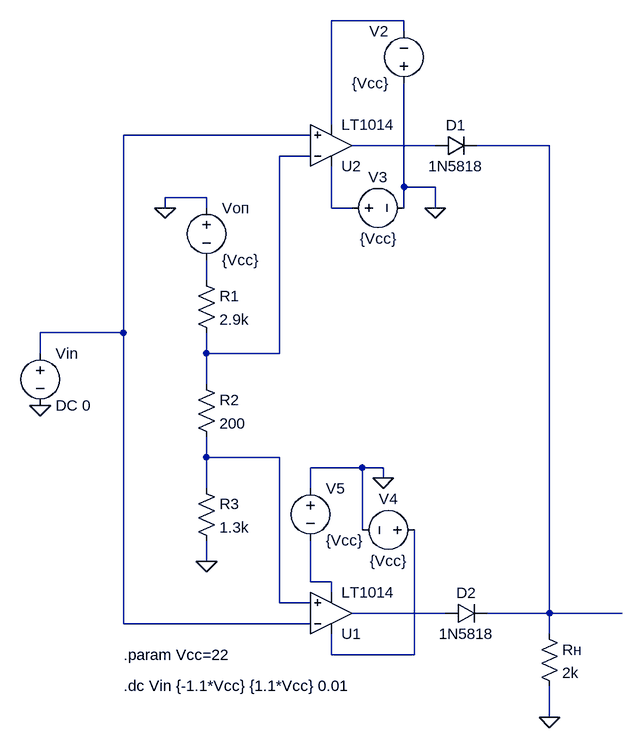
[diagram p0: schematic scheme11.asc]
scheme11.asc, the LTspice schematic file:
Version 4.1
SHEET 1 880 848
WIRE 400 -336 288 -336
WIRE 400 -320 400 -336
WIRE 288 -176 288 -336
WIRE 256 -160 -32 -160
WIRE 448 -144 320 -144
WIRE 624 -144 512 -144
WIRE 256 -128 208 -128
WIRE 400 -80 400 -240
WIRE 448 -80 400 -80
WIRE 96 -64 32 -64
WIRE 32 -48 32 -64
WIRE 96 -48 96 -64
WIRE 288 -48 288 -112
WIRE 320 -48 288 -48
WIRE 400 -48 400 -80
WIRE 448 -48 448 -80
WIRE 96 64 96 32
WIRE -32 144 -32 -160
WIRE -32 144 -160 144
WIRE -160 176 -160 144
WIRE 96 176 96 144
WIRE 208 176 208 -128
WIRE 208 176 96 176
WIRE 96 224 96 176
WIRE 96 336 96 304
WIRE 208 336 96 336
WIRE 336 352 256 352
WIRE 368 352 336 352
WIRE 368 368 368 352
WIRE 96 384 96 336
WIRE 256 384 256 352
WIRE 336 448 336 352
WIRE 96 496 96 464
WIRE 256 528 256 464
WIRE 288 528 256 528
WIRE 288 544 288 528
WIRE 208 560 208 336
WIRE 256 560 208 560
WIRE 464 576 320 576
WIRE 624 576 624 -144
WIRE 624 576 528 576
WIRE 736 576 624 576
WIRE -32 592 -32 144
WIRE 256 592 -32 592
WIRE 624 608 624 576
WIRE 288 640 288 608
WIRE 416 640 416 448
WIRE 416 640 288 640
WIRE 624 736 624 688
FLAG 624 736 0
FLAG -160 256 0
FLAG 448 -48 0
FLAG 368 368 0
FLAG 32 -48 0
FLAG 96 496 0
SYMBOL res 80 48 R0
SYMATTR InstName R1
SYMATTR Value 2.9k
SYMBOL res 80 208 R0
SYMATTR InstName R2
SYMATTR Value 200
SYMBOL res 80 368 R0
SYMATTR InstName R3
SYMATTR Value 1.3k
SYMBOL voltage -160 160 R0
SYMATTR InstName Vin
SYMATTR Value DC 0
SYMBOL res 608 592 R0
SYMATTR InstName Rн
SYMATTR Value 2k
SYMBOL voltage 400 -224 R180
WINDOW 0 24 96 Left 2
WINDOW 3 24 16 Left 2
SYMATTR InstName V2
SYMATTR Value {Vcc}
SYMBOL voltage 304 -48 R270
WINDOW 0 32 56 VTop 2
WINDOW 3 -32 56 VBottom 2
SYMATTR InstName V3
SYMATTR Value {Vcc}
SYMBOL voltage 432 448 R90
WINDOW 0 -32 56 VBottom 2
WINDOW 3 32 56 VTop 2
SYMATTR InstName V4
SYMATTR Value {Vcc}
SYMBOL voltage 256 368 R0
SYMATTR InstName V5
SYMATTR Value {Vcc}
SYMBOL OpAmps\\LT1014 288 640 M180
SYMATTR InstName U1
SYMBOL OpAmps\\LT1014 288 -80 M180
SYMATTR InstName U2
SYMBOL diode 448 -128 R270
WINDOW 0 32 32 VTop 2
WINDOW 3 0 32 VBottom 2
SYMATTR InstName D1
SYMATTR Value 1N5818
SYMBOL diode 464 592 R270
WINDOW 0 32 32 VTop 2
WINDOW 3 0 32 VBottom 2
SYMATTR InstName D2
SYMATTR Value 1N5818
SYMBOL voltage 96 -64 R0
SYMATTR InstName Vоп
SYMATTR Value {Vcc}
TEXT -32 640 Left 2 !.param Vcc=22
TEXT -32 688 Left 2 !.dc Vin {-1.1*Vcc} {1.1*Vcc} 0.01

The netlist it stands for:
* scheme11.asc
R1 N007 N005 2.9k
R2 N005 N008 200
R3 N008 0 1.3k
Vin N002 0 DC 0
Rн N004 0 2k
V2 0 N001 {Vcc}
V3 N006 0 {Vcc}
V4 N011 0 {Vcc}
V5 0 N009 {Vcc}
X§U1 N008 N002 N011 N009 N010 LT1014  ; pins In+ In- V+ V- OUT
X§U2 N002 N005 N006 N001 N003 LT1014  ; pins In+ In- V+ V- OUT
D1 N003 N004 1N5818
D2 N010 N004 1N5818
Vоп 0 N007 {Vcc}
.model D D
.lib standard.dio
.param Vcc=22
.dc Vin {-1.1*Vcc} {1.1*Vcc} 0.01
.backanno
.end